# Altium schematic sheet ADC_Core.SchDoc
size A2
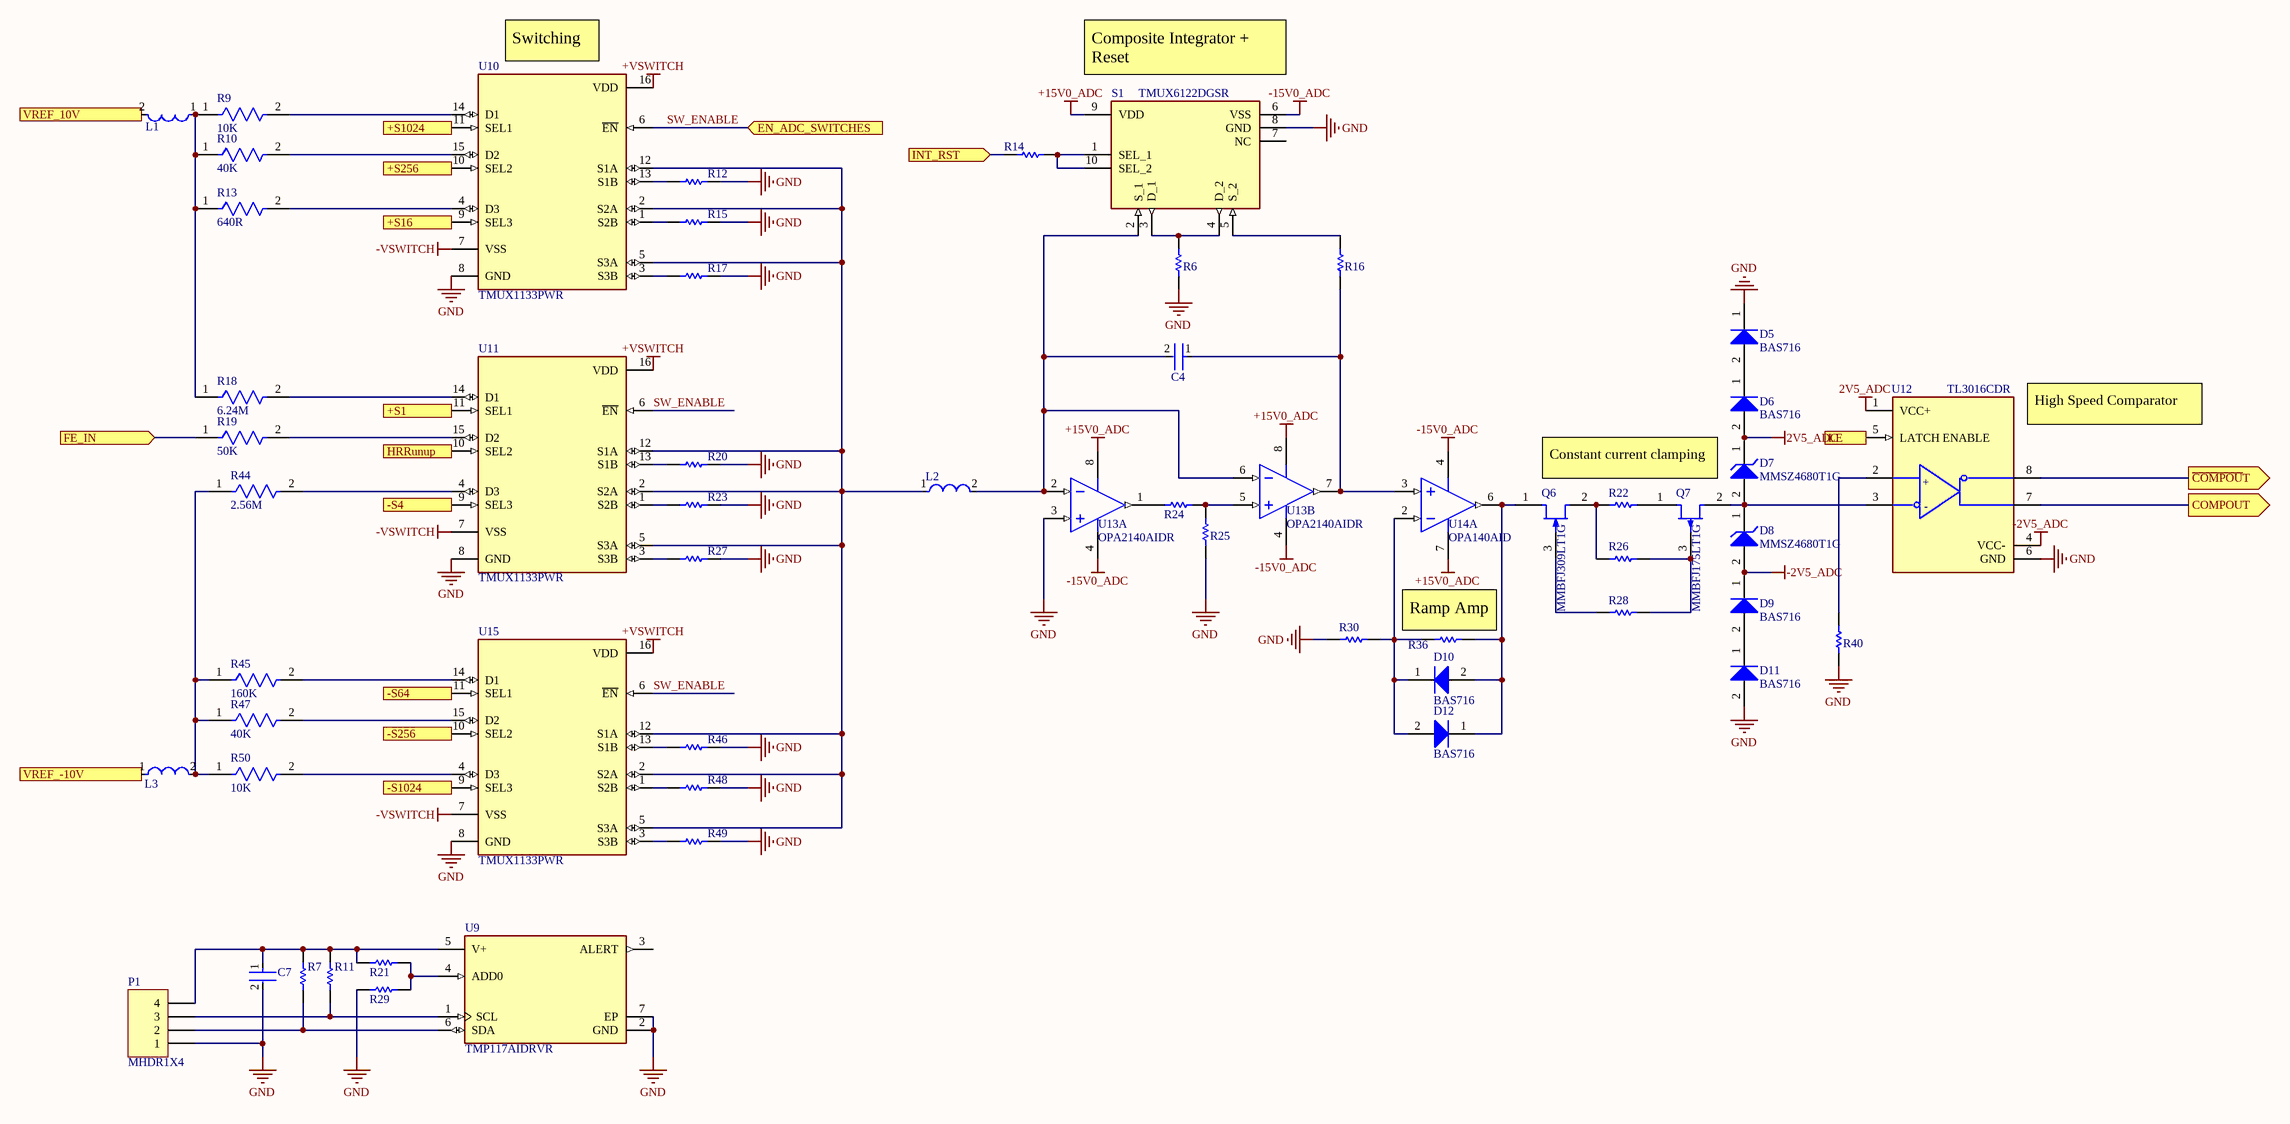
[diagram p0: ADC_Core.SchDoc]

## Parts
C4  C1206C331J5GACTU  [FP-C1206C-EB-MFG]  (value not drawn)
C7  C0402C104K8PACTU  [FP-C0402-BB-MFG]  (value not drawn)
D5  BAS716  [ONSC-SOD-523-2-502-01_V]
D6  BAS716  [ONSC-SOD-523-2-502-01_V]
D7  MMSZ4680T1G  [ONSC-SOD-123-2-425-04_V]
D8  MMSZ4680T1G  [ONSC-SOD-123-2-425-04_V]
D9  BAS716  [ONSC-SOD-523-2-502-01_V]
D10  BAS716  [ONSC-SOD-523-2-502-01_V]
D11  BAS716  [ONSC-SOD-523-2-502-01_V]
D12  BAS716  [ONSC-SOD-523-2-502-01_V]
L1  LQW15ANR10J00D  [FP-LQW15AN_00-W0_5-0_1-MFG]  (value not drawn)
L2  LQW15ANR10J00D  [FP-LQW15AN_00-W0_5-0_1-MFG]  (value not drawn)
L3  LQW15ANR10J00D  [FP-LQW15AN_00-W0_5-0_1-MFG]  (value not drawn)
P1  MHDR1X4  [MHDR1X4]
Q6  MMBFJ309LT1G  [ONSC-SOT-23-3-318-08_V]
Q7  MMBFJ175LT1G  [ONSC-SOT-23-3-318-08_V]
R6  ERJ-3GEYJ202V  [RESC1608X55X30ML15T15]  (value not drawn)
R7  CRCW04021K20FKED  [RESC1005X40X25NL05T05]  (value not drawn)
R9  10K  [FP-RC1206-MFG]
R10  40K  [FP-RC1206-MFG]
R11  CRCW04021K20FKED  [RESC1005X40X25NL05T05]  (value not drawn)
R12  ERJ-3GEYJ202V  [RESC1608X55X30ML15T15]  (value not drawn)
R13  640R  [FP-RC1206-MFG]
R14  ERJ-3GEYJ202V  [RESC1608X55X30ML15T15]  (value not drawn)
R15  ERJ-3GEYJ202V  [RESC1608X55X30ML15T15]  (value not drawn)
R16  ERJ-3GEYJ202V  [RESC1608X55X30ML15T15]  (value not drawn)
R17  ERJ-3GEYJ202V  [RESC1608X55X30ML15T15]  (value not drawn)
R18  6.24M  [FP-RC1206-MFG]
R19  50K  [FP-RC1206-MFG]
R20  ERJ-3GEYJ202V  [RESC1608X55X30ML15T15]  (value not drawn)
R21  CRCW04021K20FKED  [RESC1005X40X25NL05T05]  (value not drawn)
R22  ERJ-3GEYJ202V  [RESC1608X55X30ML15T15]  (value not drawn)
R23  ERJ-3GEYJ202V  [RESC1608X55X30ML15T15]  (value not drawn)
R24  ERJ-3GEYJ202V  [RESC1608X55X30ML15T15]  (value not drawn)
R25  ERJ-3GEYJ202V  [RESC1608X55X30ML15T15]  (value not drawn)
R26  ERJ-3EKF4220V  [RESC1608X55X30ML15T15]  (value not drawn)
R27  ERJ-3GEYJ202V  [RESC1608X55X30ML15T15]  (value not drawn)
R28  ERJ-3GEYJ202V  [RESC1608X55X30ML15T15]  (value not drawn)
R29  CRCW04021K20FKED  [RESC1005X40X25NL05T05]  (value not drawn)
R30  ERJ-3GEYJ202V  [RESC1608X55X30ML15T15]  (value not drawn)
R36  ERJ-3GEYJ202V  [RESC1608X55X30ML15T15]  (value not drawn)
R40  ERJ-3GEYJ202V  [RESC1608X55X30ML15T15]  (value not drawn)
R44  2.56M  [FP-RC1206-MFG]
R45  160K  [FP-RC1206-MFG]
R46  ERJ-3GEYJ202V  [RESC1608X55X30ML15T15]  (value not drawn)
R47  40K  [FP-RC1206-MFG]
R48  ERJ-3GEYJ202V  [RESC1608X55X30ML15T15]  (value not drawn)
R49  ERJ-3GEYJ202V  [RESC1608X55X30ML15T15]  (value not drawn)
R50  10K  [FP-RC1206-MFG]
S1  TMUX6122DGSR  [SOP50P490X110-10N]
U9  TMP117AIDRVR  [FP-DRV0006A-MFG]
U10  TMUX1133PWR  [FP-PW0016A-MFG]
U11  TMUX1133PWR  [FP-PW0016A-MFG]
U12  TL3016CDR  [FP-D0008A-IPC_A]
U13  OPA2140AIDR  [D0008A_M]  (parts A,B of 2)
U14  OPA140AID  [D0008A_M]  (part A of 2)
U15  TMUX1133PWR  [FP-PW0016A-MFG]

## Ports
+S1 (in), +S16 (in), +S256 (in), +S1024 (in), -S4 (in), -S64 (in), -S256 (in), -S1024 (in), COMPOUT (out), EN_ADC_SWITCHES (in), FE_IN (in), HRRunup (in), INT_RST (in), LE (in), VREF_10V (in), VREF_-10V (in), ~{COMPOU}T (out)

## Nets
2V5_ADC: D6.2(A) D7.1(K) U12.1(VCC+)
+15V0_ADC: S1.9(VDD) U13.8(V+) U14.7(V+)
+VSWITCH: U10.16(VDD) U11.16(VDD) U15.16(VDD)
-2V5_ADC: D8.2(A) D9.1(K) U12.4(VCC-)
-15V0_ADC: S1.6(VSS) U13.4(V-) U14.4(V-)
-VSWITCH: U10.7(VSS) U11.7(VSS) U15.7(VSS)
GND: C7.2 D5.1(K) D11.2(A) P1.1 R6.1 R12.2 R15.2 R17.2 R20.2 R23.2 R25.1 R27.2 R29.2 R30.1 R40.1 R46.2 R48.2 R49.2 S1.8(GND) U9.2(GND) U9.7(EP) U10.8(GND) U11.8(GND) U12.6(GND) U13.3(IN_A+) U15.8(GND)
+S1: U11.11(SEL1) ; port +S1
+S16: U10.9(SEL3) ; port +S16
+S256: U10.10(SEL2) ; port +S256
+S1024: U10.11(SEL1) ; port +S1024
-S4: U11.9(SEL3) ; port -S4
-S64: U15.11(SEL1) ; port -S64
-S256: U15.10(SEL2) ; port -S256
-S1024: U15.9(SEL3) ; port -S1024
~{COMPOU}T: U12.8(~{Q_OUT}) ; port ~{COMPOU}T
COMPOUT: U12.7(Q_OUT) ; port COMPOUT
FE_IN: R19.1 ; port FE_IN
HRRunup: U11.10(SEL2) ; port HRRunup
INT_RST: R14.2 ; port INT_RST
LE: U12.5(LATCH_ENABLE) ; port LE
SW_ENABLE: U10.6(~{EN}) U11.6(~{EN}) U15.6(~{EN}) ; port EN_ADC_SWITCHES
VREF_10V: L1.2 ; port VREF_10V
VREF_-10V: L3.1 ; port VREF_-10V
NetC4_1: C4.1 R16.1 U13.7(OUT_B) U14.3(IN+)
NetC4_2: C4.2 L2.2 S1.2(S_1) U13.2(IN_A-) U13.6(IN_B-)
NetC7_1: C7.1 P1.4 R7.2 R11.2 R21.2 U9.5(V+)
NetD5_2: D5.2(A) D6.1(K)
NetD7_2: D7.2(A) D8.1(K) Q7.2(S) U12.3(IN-)
NetD9_2: D9.2(A) D11.1(K)
NetD10_1: D10.1(K) D12.2(A) R30.2 R36.1 U14.2(IN-)
NetD10_2: D10.2(A) D12.1(K) Q6.1(D) R36.2 U14.6(OUT)
NetL1_1: L1.1 R9.1 R10.1 R13.1 R18.1
NetL2_1: L2.1 U10.2(S2A) U10.5(S3A) U10.12(S1A) U11.2(S2A) U11.5(S3A) U11.12(S1A) U15.2(S2A) U15.5(S3A) U15.12(S1A)
NetL3_2: L3.2 R44.1 R45.1 R47.1 R50.1
NetP1_2: P1.2 R7.1 U9.6(SDA)
NetP1_3: P1.3 R11.1 U9.1(SCL)
NetQ6_2: Q6.2(S) R22.1 R26.1
NetQ6_3: Q6.3(G) R28.1
NetQ7_1: Q7.1(D) R22.2
NetQ7_3: Q7.3(G) R26.2 R28.2
NetR6_2: R6.2 S1.3(D_1) S1.4(D_2)
NetR9_2: R9.2 U10.14(D1)
NetR10_2: R10.2 U10.15(D2)
NetR12_1: R12.1 U10.13(S1B)
NetR13_2: R13.2 U10.4(D3)
NetR14_1: R14.1 S1.1(SEL_1) S1.10(SEL_2)
NetR15_1: R15.1 U10.1(S2B)
NetR16_2: R16.2 S1.5(S_2)
NetR17_1: R17.1 U10.3(S3B)
NetR18_2: R18.2 U11.14(D1)
NetR19_2: R19.2 U11.15(D2)
NetR20_1: R20.1 U11.13(S1B)
NetR21_1: R21.1 R29.1 U9.4(ADD0)
NetR23_1: R23.1 U11.1(S2B)
NetR24_1: R24.1 R25.2 U13.5(IN_B+)
NetR24_2: R24.2 U13.1(OUT_A)
NetR27_1: R27.1 U11.3(S3B)
NetR40_2: R40.2 U12.2(IN+)
NetR44_2: R44.2 U11.4(D3)
NetR45_2: R45.2 U15.14(D1)
NetR46_1: R46.1 U15.13(S1B)
NetR47_2: R47.2 U15.15(D2)
NetR48_1: R48.1 U15.1(S2B)
NetR49_1: R49.1 U15.3(S3B)
NetR50_2: R50.2 U15.4(D3)

Not connected (* = marked no-connect by the designer): S1 7(NC); U9 3(ALERT)

## Notes on the sheet
- (near U10) Switching
- (near S1) Composite Integrator + Reset
- (near U12) High Speed Comparator
- Constant current clamping
- (near R36) Ramp Amp
- (in symbol CMP-04896-000132-1) +

## Library data of the parts
C4 = CMP-03020-027730-1: CAP CER 330PF 50V 5% NP0 1206; Manufacturer: KEMET; Temperature Characteristic: C0G; Tolerance: 0.05; Material: Ceramic; Automotive Grade: Grade 0; Temperature Coefficient: 15%; Value: 330 pF; Capacitance: 330 pF; Voltage Rating: 50 V; Category: Cap; ComponentLink2Description: Datasheet; Octopart: https://octopart.com/c1206c331j5gactu-kemet-3859988; Lead Free: Yes; Automotive: Yes; ComponentLink2URL: https://content.kemet.com/datasheets/KEM_C1007_X8R_ULTRA_150C_SMD.pdf; Device Class L2: Capacitors; Digikey Description: CAP CER 330PF 50V 5% NP0 1206; Mouser Description: Multilayer Ceramic Capacitors MLCC - SMD/SMT 50volts 330pF C0G 5%; Manufacturer Part Number: C1206C331J5GACTU; Temperature Range High: +150°C; Package: C1206C-EB; Height: 0.88mm; Ipc Land Pattern Name: CAPC320160X78; Temperature Range Low: -55°C; Device Class L3: Ceramic Capacitors; Temperature: -55°C to +150°C; Device Class L1: Passive Components; RoHS: TRUE
C7 = CMP-2008-02046-2: CAP CER 0.1UF 10V X5R 0402; Manufacturer: Kemet; Material: Ceramic; Capacitance: 0.10 μF; Temperature Coefficient: 15%; Description: C0402 0.10 μF X5R 10.00% 10 V; Tolerance: 0.1; Value: 0.10 μF; Package: C0402-BB; Temperature: -55°C to +125°C; ComponentLink2Description: Datasheet; Temperature Characteristic: X5R; Device Class L1: Passive Components; Height: 0.55mm; Lead Free: Yes; ComponentLink2URL: https://content.kemet.com/datasheets/KEM_C1002_X7R_SMD.pdf; Device Class L2: Capacitors; Temperature Range Low: -55°C; Temperature Range High: +125°C; RoHS: TRUE; Octopart: https://octopart.com/c0402c104k8pactu-kemet-140039; Automotive: No; Mouser Description: Capacitor 100 nF 10 VDC 0402; Category: Cap; Voltage Rating: 10 V; Digikey Description: CAP CER 0.1UF 10V X5R 0402; Ipc Land Pattern Name: CAPC10050X50; Device Class L3: Ceramic Capacitors; Manufacturer Part Number: C0402C104K8PACTU
D5 D6 D9-D12 = CMP-1055-00490-1: Schottky Barrier Diode, 2-Pin SOD-523, Pb-Free, Tape and Reel; PartNumber: BAT54XV2T5G; Manufacturer: On Semiconductor; IFSM Max (A): 0.6; trr Max (ns): 5; Configuration: Single; PackageDescription: 2-Pin SOD, Body 1.2 x 0.8 mm; PackageReference: SOD-523-2-502-01; DatasheetVersion: Rev. 8; Packing: Tape and Reel; PackageVersion: Rev. E, 09/2010; ComponentLink2Description: Datasheet; ComponentLink3URL: http://www.onsemi.com/pub_link/Collateral/502-01.PDF; RoHS: TRUE; ComponentLink2URL: http://www.onsemi.cn/pub_link/Collateral/BAT54XV2T1-D.PDF; ComponentLink1Description: Manufacturer URL; Mounting Technology: Surface Mount; ComponentLink3Description: Package Specification; ComponentLink1URL: http://www.onsemi.com/
D7 D8 = CMP-1060-00604-1: Zener Voltage Regulator, 500 mW, 2-Pin SOD-123, Pb-Free, Tape and Reel; Manufacturer: On Semiconductor; P Max (W): 0.5; VZ Typ (V): 2.2; DatasheetVersion: Rev. 9; PackageReference: SOD-123-2-425-04; PackageDescription: 2-Pin SOD, Body 1.6 x 2.69 mm; ComponentLink3URL: http://www.onsemi.com/pub_link/Collateral/425-04.PDF; ComponentLink1Description: Manufacturer URL; ComponentLink1URL: http://www.onsemi.com/; ComponentLink3Description: Package Specification; PackageVersion: Rev. G, 10/2009; Packing: Tape and Reel; PartNumber: MMSZ4680T1G; ComponentLink2Description: Datasheet; RoHS: Pb-Free; ComponentLink2URL: http://www.onsemi.com/pub_link/Collateral/MMSZ4678T1-D.PDF; Mounting Technology: Surface Mount
L1-L3 = CMP-06042-005024-1: Wire Wound RF Inductor 100nH ±5% 120mA 2.52Ω 0402 (1005); DC Resistance (DCR): 2.52R; Core Material: Air; Test Frequency: 100MHz; Self Resonant Frequency: 1.5GHz; Shielding: Unshielded; Length: 1mm; Radiation Hardening: No; REACH SVHC: No SVHC; Case Code (Metric): 1005; Inductance Tolerance: 5%; Weight: 2.8E-05oz; Case/Package: 0402; Mount: Surface Mount; Number of Pins: 2; Height: 0.5mm; Max DC Current: 120mA; Max Operating Temperature: 125°C; Termination: SMD/SMT; Min Operating Temperature: -55°C; DC Current: 120mA; Depth: 0.6mm; Current Rating: 120mA; Tolerance: 5%; Inductance: 100nH; Package Quantity: 10000; Lead Free: Lead Free; Case Code (Imperial): 0402; Packaging: Tape and Reel; Width: 0.5mm; Military Standard: Not
P1 = MHDR1X4: Header, 4-Pin; LatestRevisionDate: 17-Jul-2002; LatestRevisionNote: Re-released for DXP Platform.; Publisher: Altium Limited
Q6 = CMP-1062-00028-1: JFET - VHF / UHF Amplifier Transistor, N-Channel, 3-Pin SOT-23, Pb-Free, Tape and Reel; Manufacturer: On Semiconductor; IDSS Max (uA): 30000; Ciss Max (pF): 5; Crss Max (pF): 2.5; IDSS Min (uA): 12000; V(BR)GSS Min (V): 25; Channel Polarity: N Channel; DatasheetVersion: Rev. 7; RoHS: Pb-Free; ComponentLink2URL: http://www.onsemi.cn/pub_link/Collateral/MMBFJ309LT1-D.PDF; ComponentLink3Description: Package Specification; Packing: Tape and Reel; Mounting Technology: Surface Mount; PartNumber: MMBFJ309LT1G; PackageReference: SOT-23-3-318-08; PackageVersion: Rev. AP, 11/2009; ComponentLink1URL: http://www.onsemi.com/; ComponentLink3URL: http://www.onsemi.cn/pub_link/Collateral/318-08.PDF; ComponentLink1Description: Manufacturer URL; PackageDescription: 3-Pin Small Outline Transistor, Body 2.92 x 1.3 mm, Pitch 0.95 mm; ComponentLink2Description: Datasheet
Q7 = CMP-1062-00050-1: JFET Chopper, P-Channel - Depletion, 3-Pin SOT-23, Pb-Free, Tape and Reel; Manufacturer: On Semiconductor; IDSS Min (uA): 7000; Channel Polarity: P Channel; Ciss Max (pF): 11; V(BR)GSS Min (V): 30; IDSS Max (uA): 60000; Crss Max (pF): 5.5; PackageVersion: Rev. AP, 11/2009; DatasheetVersion: Rev. 5; ComponentLink1Description: Manufacturer URL; ComponentLink1URL: http://www.onsemi.com/; ComponentLink2URL: http://www.onsemi.com/pub_link/Collateral/MMBFJ175LT1-D.PDF; PartNumber: MMBFJ175LT1G; PackageDescription: 3-Pin Small Outline Transistor, Body 2.92 x 1.3 mm, Pitch 0.95 mm; RoHS: Pb-Free; ComponentLink3URL: http://www.onsemi.cn/pub_link/Collateral/318-08.PDF; ComponentLink2Description: Datasheet; Packing: Tape and Reel; Mounting Technology: Surface Mount; ComponentLink3Description: Package Specification; PackageReference: SOT-23-3-318-08
R6 R12 R14-R17 R20 R22-R25 R27 R28 R30 R36 R40 R46 R48 R49 = CMP-2000-00741-1: Manufacturer: Panasonic; Part Number: ERJ-3GEYJ202V
R7 R11 R21 R29 = CMP-2002-08284-1: Manufacturer: Vishay Dale; Part Number: CRCW04021K20FKED
R9 R10 R13 R18 R19 R44 R45 R47 R50 = CMP-2100-03681-2: RES SMD 0 OHM JUMPER 1/4W 1206; Manufacturer Part Number: RC1206JR-070RL; Manufacturer: YAGEO; Voltage Rating: 200V; Temperature Coefficient: 300ppm/°C; Power Rating: 0.25W; Value: 0Ω; Tolerance: 5%; Temperature Range Low: -55°C; Category: Res; Automotive: No; Ipc Land Pattern Name: RESC310160X55; Device Class L1: Passive Components; Temperature: -55°C to +155°C; ComponentLink2URL: https://www.yageo.com/upload/media/product/productsearch/datasheet/rchip/PYu-RC_Group_51_RoHS_L_10.pdf; Lead Free: Yes; Height: 0.65mm; Footprint Url: https://www.yageo.com/upload/website/yageo_PYu-R_Mount_10_19050818_343.pdf; Package: RC1206; Digikey Description: RES SMD 0 OHM JUMPER 1/4W 1206; Temperature Range High: +155°C; Device Class L3: Chip SMD Resistors; Device Class L2: Resistors; Octopart: https://octopart.com/rc1206jr-070rl-yageo-40025601; Resistance: 0Ω; Series: RC; ComponentLink2Description: Datasheet; Composition: Thick Film; RoHS: TRUE; Mouser Description: Resistor: thick film; SMD; 1206; 0O; 0.25W; ±5%; -55÷155°C
R26 = CMP-2000-00493-1: Manufacturer: Panasonic; Part Number: ERJ-3EKF4220V
S1 = TMUX6122DGSR: Switch; Manufacturer_Name: Texas Instruments; Datasheet Link: http://www.ti.com/lit/gpn/TMUX6122; Height: 1.1mm; Manufacturer_Part_Number: TMUX6122DGSR; Mouser Part Number: 595-TMUX6122DGSR; Mouser Price/Stock: https://www.mouser.co.uk/ProductDetail/Texas-Instruments/TMUX6122DGSR?qs=l7cgNqFNU1g7U5Em%252B8JhAQ%3D%3D; Arrow Part Number: TMUX6122DGSR; Arrow Price/Stock: https://www.arrow.com/en/products/tmux6122dgsr/texas-instruments
U9 = CMP-04948-000009-1: TEMPERATURE SENSOR; Manufacturer: Texas Instruments; Operating Supply Current: 3.5-16uA; Standoff Height: 0mm; Min Supply Voltage: 1.8V; Resolution: 16bits; Description: Temperature Sensor Digital, Local -55°C ~ 150°C 16 b 6-WSON (2x2); Interface: I2C,2-Wire,SMBus; Max Junction Temp: +150°C; Max Supply Voltage: 5.5V; Octopart: https://octopart.com/tmp117aidrvr-texas+instruments-95511044; Lead Free: Yes; ComponentLink2Description: Datasheet; Temperature Range High: +150°C; Manufacturer Part Number: TMP117AIDRVR; Ambient Temperature Range High: +150°C; Ambient Temperature Range Low: -55°C; Height: 0.8mm; ComponentLink2URL: http://www.ti.com/lit/ds/symlink/tmp117.pdf; Automotive: No; Device Class L1: Sensors; RoHS: TRUE; Package: DRV0006A; Device Class L3: unset; Temperature: -55°C to +150°C; Temperature Range Low: -55°C; Ipc Land Pattern Name: DFN200X200X80-6; Device Class L2: Temperature and Humidity Sensors; Category: IC; Digikey Description: TEMPERATURE SENSOR
U10 U11 U15 = CMP-04892-000026-1: IC SWITCH
U12 = CMP-04896-000132-1: IC PREC COMP ULTRA-FAST 8-SOIC; Power Dissipation: 725mW; Dual Supply Voltage: 5V; Nominal Supply Current: 10.6mA; Max Supply Voltage: 10V; Common Mode Rejection Ratio: 97dB; Output Type: TTL; Response Time: 0.0078us; Max Input Current: 10uA; Power Supply Rejection Ratio (PSRR): 72dB; Number of Elements: 1; Output Current: 20mA; Propagation Delay: 10ns; Quiescent Current: 12.5mA; Input Offset Voltage (Vos): 3mV; Min Operating Temperature: -40°C; Series: -; Length: 4.9mm; Width: 3.91mm; Radiation Hardening: No; Height: 1.58mm; Number of Pins: 8; Supply Current: 10.6mA; Max Operating Temperature: 85°C; Weight: 0.002561oz; Technology: BICMOS; Mount: Surface Mount; Min Supply Voltage: 5V; Package Quantity: 2500; Number of Channels: 1; Case/Package: SOIC; RoHS Compliant: Yes; Max Supply Current: 12.5mA; Lead Free: Lead Free; Max Power Dissipation: 725mW; Packaging: Tape and Reel; Input Bias Current: 10uA
U13 = CMP-0272-00256-3: 11 MHz, Precision, Low Noise, Rail-to-Rail Output, JFET Operational Amplifier, 4.5 to 36 V, -40 to 125 degC, 8-pin SOIC (D8), Green (RoHS & no Sb/Br); Manufacturer: Texas Instruments; Number of Channels: 2; Total Supply Voltage(Min)(+5V is 5, +/-5V is 10): 4.5; Vio (25C)(Max)(mV): 0.12; Total Supply Voltage(Max)(+5V is 5, +/-5V is 10): 36; Offset Drift(Typ)(uV/C): 0.35; IIB(Max)(pA): 10; GBW(Typ)(MHz): 11; Slew Rate(Typ)(V/us): 20; Packing: LARGE T&R; Sub Family: High Supply Voltage Amplifier (>=30V), Low Input Bias Current Amp (<=10pA), Low Noise Amp (<=10nV/rtHz), Low Offset Voltage Amplifier (<=500uV), Precision Amplifier; CMRR(Min)(dB): 126; Rating: Catalog; PackageReference: D0008A; ComponentLink2URL: http://www.ti.com/lit/ds/symlink/opa2140.pdf; ComponentLink1Description: Manufacturer URL; Iq per channel(Max)(mA): 2; Code_JEDEC: MS-012; PartNumber: OPA2140AIDR; Eco-Plan: Green (RoHS & no Sb/Br); ComponentLink3URL: http://www.ti.com/litv/pdf/msoi002j; ComponentLink3Description: Package Specification; ComponentLink1URL: http://www.ti.com/; DatasheetVersion: SBOS498A; PackageVersion: 4040047-3/M, 06/2011; Mounting Technology: Surface Mount; ComponentLink2Description: Datasheet; PackageDescription: 8-Pin Plastic Small Outline, Body 4.9 x 3.9 mm, Pitch 1.27 mm
U14 = CMP-0271-00131-3: 11 MHz, Single Supply, Low Noise, Precision, Rail-to-Rail Output, JFET Amplifier, 4.5 to 36 V, -40 to 125 degC, 8-pin SOIC (D8), Green (RoHS & no Sb/Br); Manufacturer: Texas Instruments; Vio (25C)(Max)(mV): 0.12; Number of Channels: 1; Packing: TUBE; Rating: Catalog; Offset Drift(Typ)(uV/C): 0.35; Sub Family: High Supply Voltage Amplifier (>=30V), Low Input Bias Current Amp (<=10pA), Low Noise Amp (<=10nV/rtHz), Low Offset Voltage Amplifier (<=500uV), Precision Amplifier; Total Supply Voltage(Min)(+5V is 5, +/-5V is 10): 4.5; Iq per channel(Max)(mA): 2; Total Supply Voltage(Max)(+5V is 5, +/-5V is 10): 36; IIB(Max)(pA): 10; GBW(Typ)(MHz): 11; CMRR(Min)(dB): 126; Slew Rate(Typ)(V/us): 20; PackageDescription: 8-Pin Plastic Small Outline, Body 4.9 x 3.9 mm, Pitch 1.27 mm; PackageReference: D0008A; ComponentLink3Description: Package Specification; ComponentLink3URL: http://www.ti.com/litv/pdf/msoi002j; DatasheetVersion: SBOS498A; Mounting Technology: Surface Mount; ComponentLink2Description: Datasheet; ComponentLink2URL: http://www.ti.com/lit/ds/symlink/opa140.pdf; ComponentLink1Description: Manufacturer URL; ComponentLink1URL: http://www.ti.com/; PackageVersion: 4040047-3/M, 06/2011; Code_JEDEC: MS-012; Eco-Plan: Green (RoHS & no Sb/Br); PartNumber: OPA140AID